# Altium schematic sheet 顶板.SchDoc
size A4
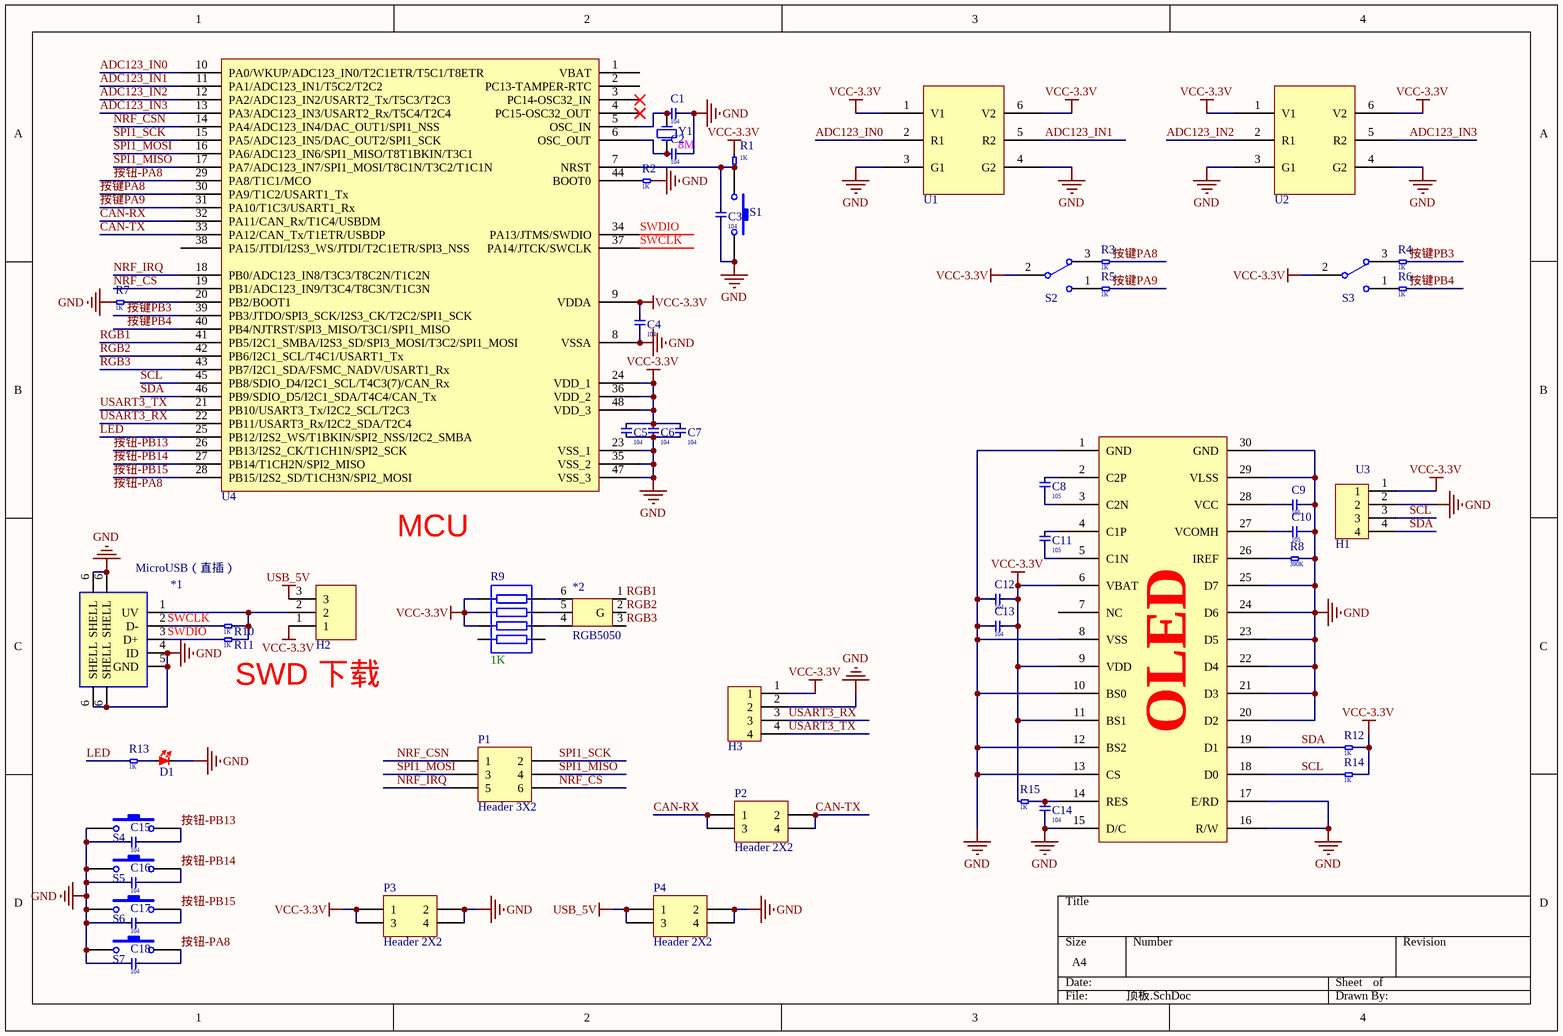
[diagram p0: 顶板.SchDoc]

## Parts
*1  MicroUSB（直插）  [MicroUSB（直插）]
*2  RGB5050  [RGB5050]
C1  CAP0603  [CAP0603]  (value not drawn)
C2  CAP0603  [CAP0603]  (value not drawn)
C3  CAP0603  [CAP0603]  (value not drawn)
C4  CAP0603  [CAP0603]  (value not drawn)
C5  CAP0603  [CAP0603]  (value not drawn)
C6  CAP0603  [CAP0603]  (value not drawn)
C7  CAP0603  [CAP0603]  (value not drawn)
C8  CAP0603  [CAP0603]  (value not drawn)
C9  CAP0603  [CAP0603]  (value not drawn)
C10  CAP0603  [CAP0603]  (value not drawn)
C11  CAP0603  [CAP0603]  (value not drawn)
C12  CAP0603  [CAP0603]  (value not drawn)
C13  CAP0603  [CAP0603]  (value not drawn)
C14  CAP0603  [CAP0603]  (value not drawn)
C15  CAP0603  [CAP0603]  (value not drawn)
C16  CAP0603  [CAP0603]  (value not drawn)
C17  CAP0603  [CAP0603]  (value not drawn)
C18  CAP0603  [CAP0603]  (value not drawn)
D1  LED  [LED_0603_B]  (value not drawn)
H1  H4  [H4]  (value not drawn)
H2  H3  [H3]  (value not drawn)
H3  H4  [H4]  (value not drawn)
P1  Header 3X2  [HDR2X3]
P2  Header 2X2  [HDR2X2]
P3  Header 2X2  [HDR2X2]
P4  Header 2X2  [HDR2X2]
R1  电阻R  [R0603]  (value not drawn)
R2  电阻R  [R0603]  (value not drawn)
R3  电阻R  [R0603]  (value not drawn)
R4  电阻R  [R0603]  (value not drawn)
R5  电阻R  [R0603]  (value not drawn)
R6  电阻R  [R0603]  (value not drawn)
R7  电阻R  [R0603]  (value not drawn)
R8  电阻R  [R0603]  (value not drawn)
R9  1K*4排阻  [1K*4排阻]  (value not drawn)
R10  电阻R  [R0603]  (value not drawn)
R11  电阻R  [R0603]  (value not drawn)
R12  电阻R  [R0603]  (value not drawn)
R13  电阻R  [R0603]  (value not drawn)
R14  电阻R  [R0603]  (value not drawn)
R15  电阻R  [R0603]  (value not drawn)
S1  SWITCH  [SWITCH]  (value not drawn)
S2  拨动开关  [拨动开关]  (value not drawn)
S3  拨动开关  [拨动开关]  (value not drawn)
S4  SWITCH  [SWITCH]  (value not drawn)
S5  SWITCH  [SWITCH]  (value not drawn)
S6  SWITCH  [SWITCH]  (value not drawn)
S7  SWITCH  [SWITCH]  (value not drawn)
U1  遥控器摇杆  [遥控器摇杆]  (value not drawn)
U2  遥控器摇杆  [遥控器摇杆]  (value not drawn)
U3  OLED  [OLED]  (value not drawn)
U4  STM32F103C8T6  [LQFP_48P]  (value not drawn)
Y1  XTAL  [XTAL]  (value not drawn)

## Nets
GND: *1.4(ID) *1.5(GND) *1.6(SHELL) C1.2 C2.2 C3.1 C4.1 C5.1 C6.1 C7.1 C9.1 C10.1 C12.2 C13.2 C14.1 C15.2 C16.2 C17.2 C18.2 D1.2 H1.2 H3.2 P3.2 P3.4 P4.2 P4.4 R2.2 R7.2 R8.1 S1.2 S4.1 S5.1 S6.1 S7.1 U1.3(G1) U1.4(G2) U2.3(G1) U2.4(G2) U3.1(GND) U3.8(VSS) U3.10(BS0) U3.12(BS2) U3.13(CS) U3.15(D/C) U3.16(R/W) U3.17(E/RD) U3.20(D2) U3.21(D3) U3.22(D4) U3.23(D5) U3.24(D6) U3.25(D7) U3.29(VLSS) U3.30(GND) U4.8(VSSA) U4.23(VSS_1) U4.35(VSS_2) U4.47(VSS_3)
USB_5V: H2.3 P4.1 P4.3
VCC-3.3V: C4.2 C5.2 C6.2 C7.2 C12.1 C13.1 H1.1 H2.1 H3.1 P3.1 P3.3 R1.2 R9.1 R9.3 R9.5 R12.1 R14.2 R15.2 S2.2 S3.2 U1.1(V1) U1.6(V2) U2.1(V1) U2.6(V2) U3.6(VBAT) U3.9(VDD) U3.11(BS1) U4.9(VDDA) U4.24(VDD_1) U4.36(VDD_2) U4.48(VDD_3)
ADC123_IN0: U1.2(R1) U4.10(PA0/WKUP/ADC123_IN0/T2C1ETR/T5C1/T8ETR)
ADC123_IN1: U1.5(R2) U4.11(PA1/ADC123_IN1/T5C2/T2C2)
ADC123_IN2: U2.2(R1) U4.12(PA2/ADC123_IN2/USART2_Tx/T5C3/T2C3)
ADC123_IN3: U2.5(R2) U4.13(PA3/ADC123_IN3/USART2_Rx/T5C4/T2C4)
CAN-RX: P2.1 P2.3 U4.32(PA11/CAN_Rx/T1C4/USBDM)
CAN-TX: P2.2 P2.4 U4.33(PA12/CAN_Tx/T1ETR/USBDP)
LED: R13.1 U4.25(PB12/I2S2_WS/T1BKIN/SPI2_NSS/I2C2_SMBA)
NRF_CS: P1.6 U4.19(PB1/ADC123_IN9/T3C4/T8C3N/T1C3N)
NRF_CSN: P1.1 U4.14(PA4/ADC123_IN4/DAC_OUT1/SPI1_NSS)
NRF_IRQ: P1.5 U4.18(PB0/ADC123_IN8/T3C3/T8C2N/T1C2N)
RGB1: *2.1(G) U4.41(PB5/I2C1_SMBA/I2S3_SD/SPI3_MOSI/T3C2/SPI1_MOSI)
RGB2: *2.2(G) U4.42(PB6/I2C1_SCL/T4C1/USART1_Tx)
RGB3: *2.3(G) U4.43(PB7/I2C1_SDA/FSMC_NADV/USART1_Rx)
SCL: H1.3 R14.1 U3.18(D0) U4.45(PB8/SDIO_D4/I2C1_SCL/T4C3(7)/CAN_Rx)
SDA: H1.4 R12.2 U3.19(D1) U4.46(PB9/SDIO_D5/I2C1_SDA/T4C4/CAN_Tx)
SPI1_MISO: P1.4 U4.17(PA7/ADC123_IN7/SPI1_MOSI/T8C1N/T3C2/T1C1N)
SPI1_MOSI: P1.3 U4.16(PA6/ADC123_IN6/SPI1_MISO/T8T1BKIN/T3C1)
SPI1_SCK: P1.2 U4.15(PA5/ADC123_IN5/DAC_OUT2/SPI1_SCK)
SWCLK: *1.2(D-) R10.1 U4.37(PA14/JTCK/SWCLK)
SWDIO: *1.3(D+) R11.1 U4.34(PA13/JTMS/SWDIO)
USART3_RX: H3.3 U4.22(PB11/USART3_Rx/I2C2_SDA/T2C4)
USART3_TX: H3.4 U4.21(PB10/USART3_Tx/I2C2_SCL/T2C3)
按钮-PA8: C18.1 S7.2 U4.29(PA8/T1C1/MCO)
按钮-PB13: C15.1 S4.2 U4.26(PB13/I2S2_CK/T1CH1N/SPI2_SCK)
按钮-PB14: C16.1 S5.2 U4.27(PB14/T1CH2N/SPI2_MISO)
按钮-PB15: C17.1 S6.2 U4.28(PB15/I2S2_SD/T1CH3N/SPI2_MOSI)
按键PA8: R3.1 U4.30(PA9/T1C2/USART1_Tx)
按键PA9: R5.1 U4.31(PA10/T1C3/USART1_Rx)
按键PB3: R4.1 U4.39(PB3/JTDO/SPI3_SCK/I2S3_CK/T2C2/SPI1_SCK)
按键PB4: R6.1 U4.40(PB4/NJTRST/SPI3_MISO/T3C1/SPI1_MISO)
Net*1_1: *1.1(UV) H2.2 R10.2 R11.2
Net*2_4: *2.4(G) R9.6
Net*2_5: *2.5(G) R9.4
Net*2_6: *2.6(G) R9.2
NetC1_1: C1.1 U4.5(OSC_IN) Y1.2(OSC2)
NetC2_1: C2.1 U4.6(OSC_OUT) Y1.1(OSC1)
NetC3_2: C3.2 R1.1 S1.1 U4.7(NRST)
NetC8_1: C8.1 U3.3(C2N)
NetC8_2: C8.2 U3.2(C2P)
NetC9_2: C9.2 U3.28(VCC)
NetC10_2: C10.2 U3.27(VCOMH)
NetC11_1: C11.1 U3.5(C1N)
NetC11_2: C11.2 U3.4(C1P)
NetC14_2: C14.2 R15.1 U3.14(RES)
NetD1_1: D1.1 R13.2
NetR2_1: R2.1 U4.44(BOOT0)
NetR3_2: R3.2 S2.3
NetR4_2: R4.2 S3.3
NetR5_2: R5.2 S2.1
NetR6_2: R6.2 S3.1
NetR7_1: R7.1 U4.20(PB2/BOOT1)
NetR8_2: R8.2 U3.26(IREF)

Not connected (* = marked no-connect by the designer): R9 7 8; U3 7(NC); U4 1(VBAT) 2(PC13-TAMPER-RTC) 3(PC14-OSC32_IN)* 4(PC15-OSC32_OUT)* 38(PA15/JTDI/I2S3_WS/JTDI/T2C1ETR/SPI3_NSS)

## Notes on the sheet
- (near U4) MCU
- SWD 下载
- Labels drawn without touching a wire or pin: 按钮-PA8
- (in symbol 1K*4排阻) 1K
- (in symbol CAP0603) 104; 105
- (in symbol XTAL) 8M
- (in symbol 电阻R) 1K; 390K

## Library data of the parts
H1 H3 = H4: 排针
H2 = H3: 排针
P1 = Header 3X2: Header, 3-Pin, Dual row; LatestRevisionDate: 17-Jul-2002; LatestRevisionNote: Re-released for DXP Platform.; Publisher: Altium Limited
P2-P4 = Header 2X2: Header, 2-Pin, Dual row; LatestRevisionDate: 17-Jul-2002; LatestRevisionNote: Re-released for DXP Platform.; Publisher: Altium Limited
S1 S4-S7 = SWITCH: 按键
S2 S3 = 拨动开关: 扭子拨动开关
U1 U2 = 遥控器摇杆: 摇杆
Y1 = XTAL: 晶振